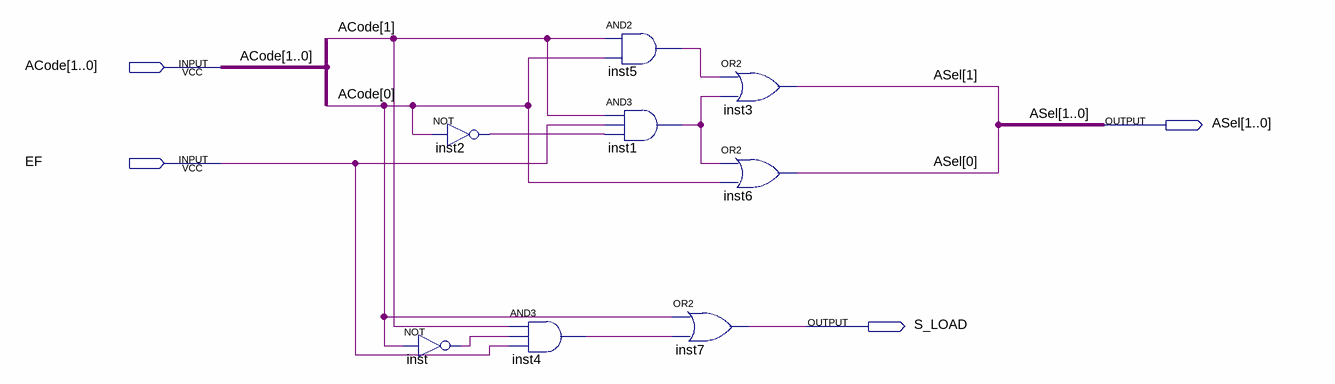
[diagram p0: schematic sheet]
// Quartus schematic MICR_ADR_CHOOSER.bdf as structural Verilog: 8 symbols, 4 pins
module MICR_ADR_CHOOSER (
  input  [1:0] ACode,
  input  EF,
  output [1:0] ASel,
  output S_LOAD
);

  wire inst1_out, inst2_out, inst4_out, inst5_out, inst_out;

  not inst2 (inst2_out, ACode[0]);
  not inst (inst_out, ACode[0]);
  and inst4 (inst4_out, ACode[1], inst_out, EF);
  and inst5 (inst5_out, ACode[1], ACode[0]);
  and inst1 (inst1_out, ACode[1], EF, inst2_out);
  or inst7 (S_LOAD, ACode[0], inst4_out);
  or inst3 (ASel[1], inst5_out, inst1_out);
  or inst6 (ASel[0], inst1_out, ACode[0]);
endmodule
